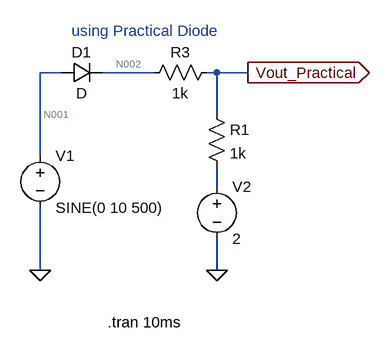
[diagram p0: schematic Draft1.asc]
Draft1.asc, the LTspice schematic file:
Version 4
SHEET 1 1380 680
WIRE 0 -64 -32 -64
WIRE 144 -64 64 -64
WIRE 240 -64 224 -64
WIRE 288 -64 240 -64
WIRE 240 0 240 -64
WIRE -32 64 -32 -64
WIRE 240 112 240 80
WIRE -32 240 -32 144
WIRE 240 240 240 192
FLAG 240 240 0
FLAG -32 240 0
FLAG 288 -64 Vout_Practical
IOPIN 288 -64 Out
SYMBOL voltage -32 48 R0
WINDOW 123 0 0 Left 0
WINDOW 39 0 0 Left 0
SYMATTR InstName V1
SYMATTR Value SINE(0 10 500)
SYMBOL voltage 240 96 R0
WINDOW 123 0 0 Left 0
WINDOW 39 0 0 Left 0
SYMATTR InstName V2
SYMATTR Value 2
SYMBOL diode 0 -48 R270
WINDOW 0 32 32 VTop 2
WINDOW 3 0 32 VBottom 2
SYMATTR InstName D1
SYMBOL res 224 -16 R0
SYMATTR InstName R1
SYMATTR Value 1k
SYMBOL res 240 -80 R90
WINDOW 0 0 56 VBottom 2
WINDOW 3 32 56 VTop 2
SYMATTR InstName R3
SYMATTR Value 1k
TEXT 16 -128 Left 2 ;using Practical Diode
TEXT 72 320 Left 2 !.tran 10ms

The netlist it stands for:
* Draft1.asc
V1 N001 0 SINE(0 10 500)
V2 N003 0 2
D1 N001 N002 D
R1 Vout_Practical N003 1k
R3 Vout_Practical N002 1k
.model D D
.lib standard.dio
* using Practical Diode
.tran 10ms
.backanno
.end

* Results of the author's LTspice run, read from the files saved beside the schematic
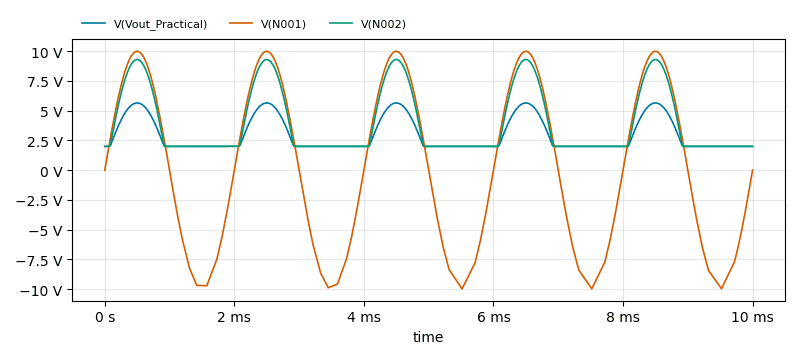
[diagram p1: Transient Analysis of Draft1.asc, plotted from the saved traces]
* Transient Analysis, 1 run:
*   V(Vout_Practical): min 2 V, max 5.654 V, average 2.98 V, rms 3.278 V, last 2 V
*   V(N001): min -9.979 V, max 10 V, average 55.78 mV, rms 7.018 V, last 0 V
*   V(N002): min 2 V, max 9.309 V, average 3.96 V, rms 4.812 V, last 2 V